# EasyEDA Pro project ProPrj_基于STM32的多功能串口分析仪_2025-03-12.epro, schematic Schematic1
Create Date: 2024-09-28; Page Name: P1; Project Name: 基于STM32的多功能串口分析仪; Schematic Name: Schematic1; Update Date: 2024-10-16; Company: 嘉立创EDA; Page Size: A4; Version: V1.0
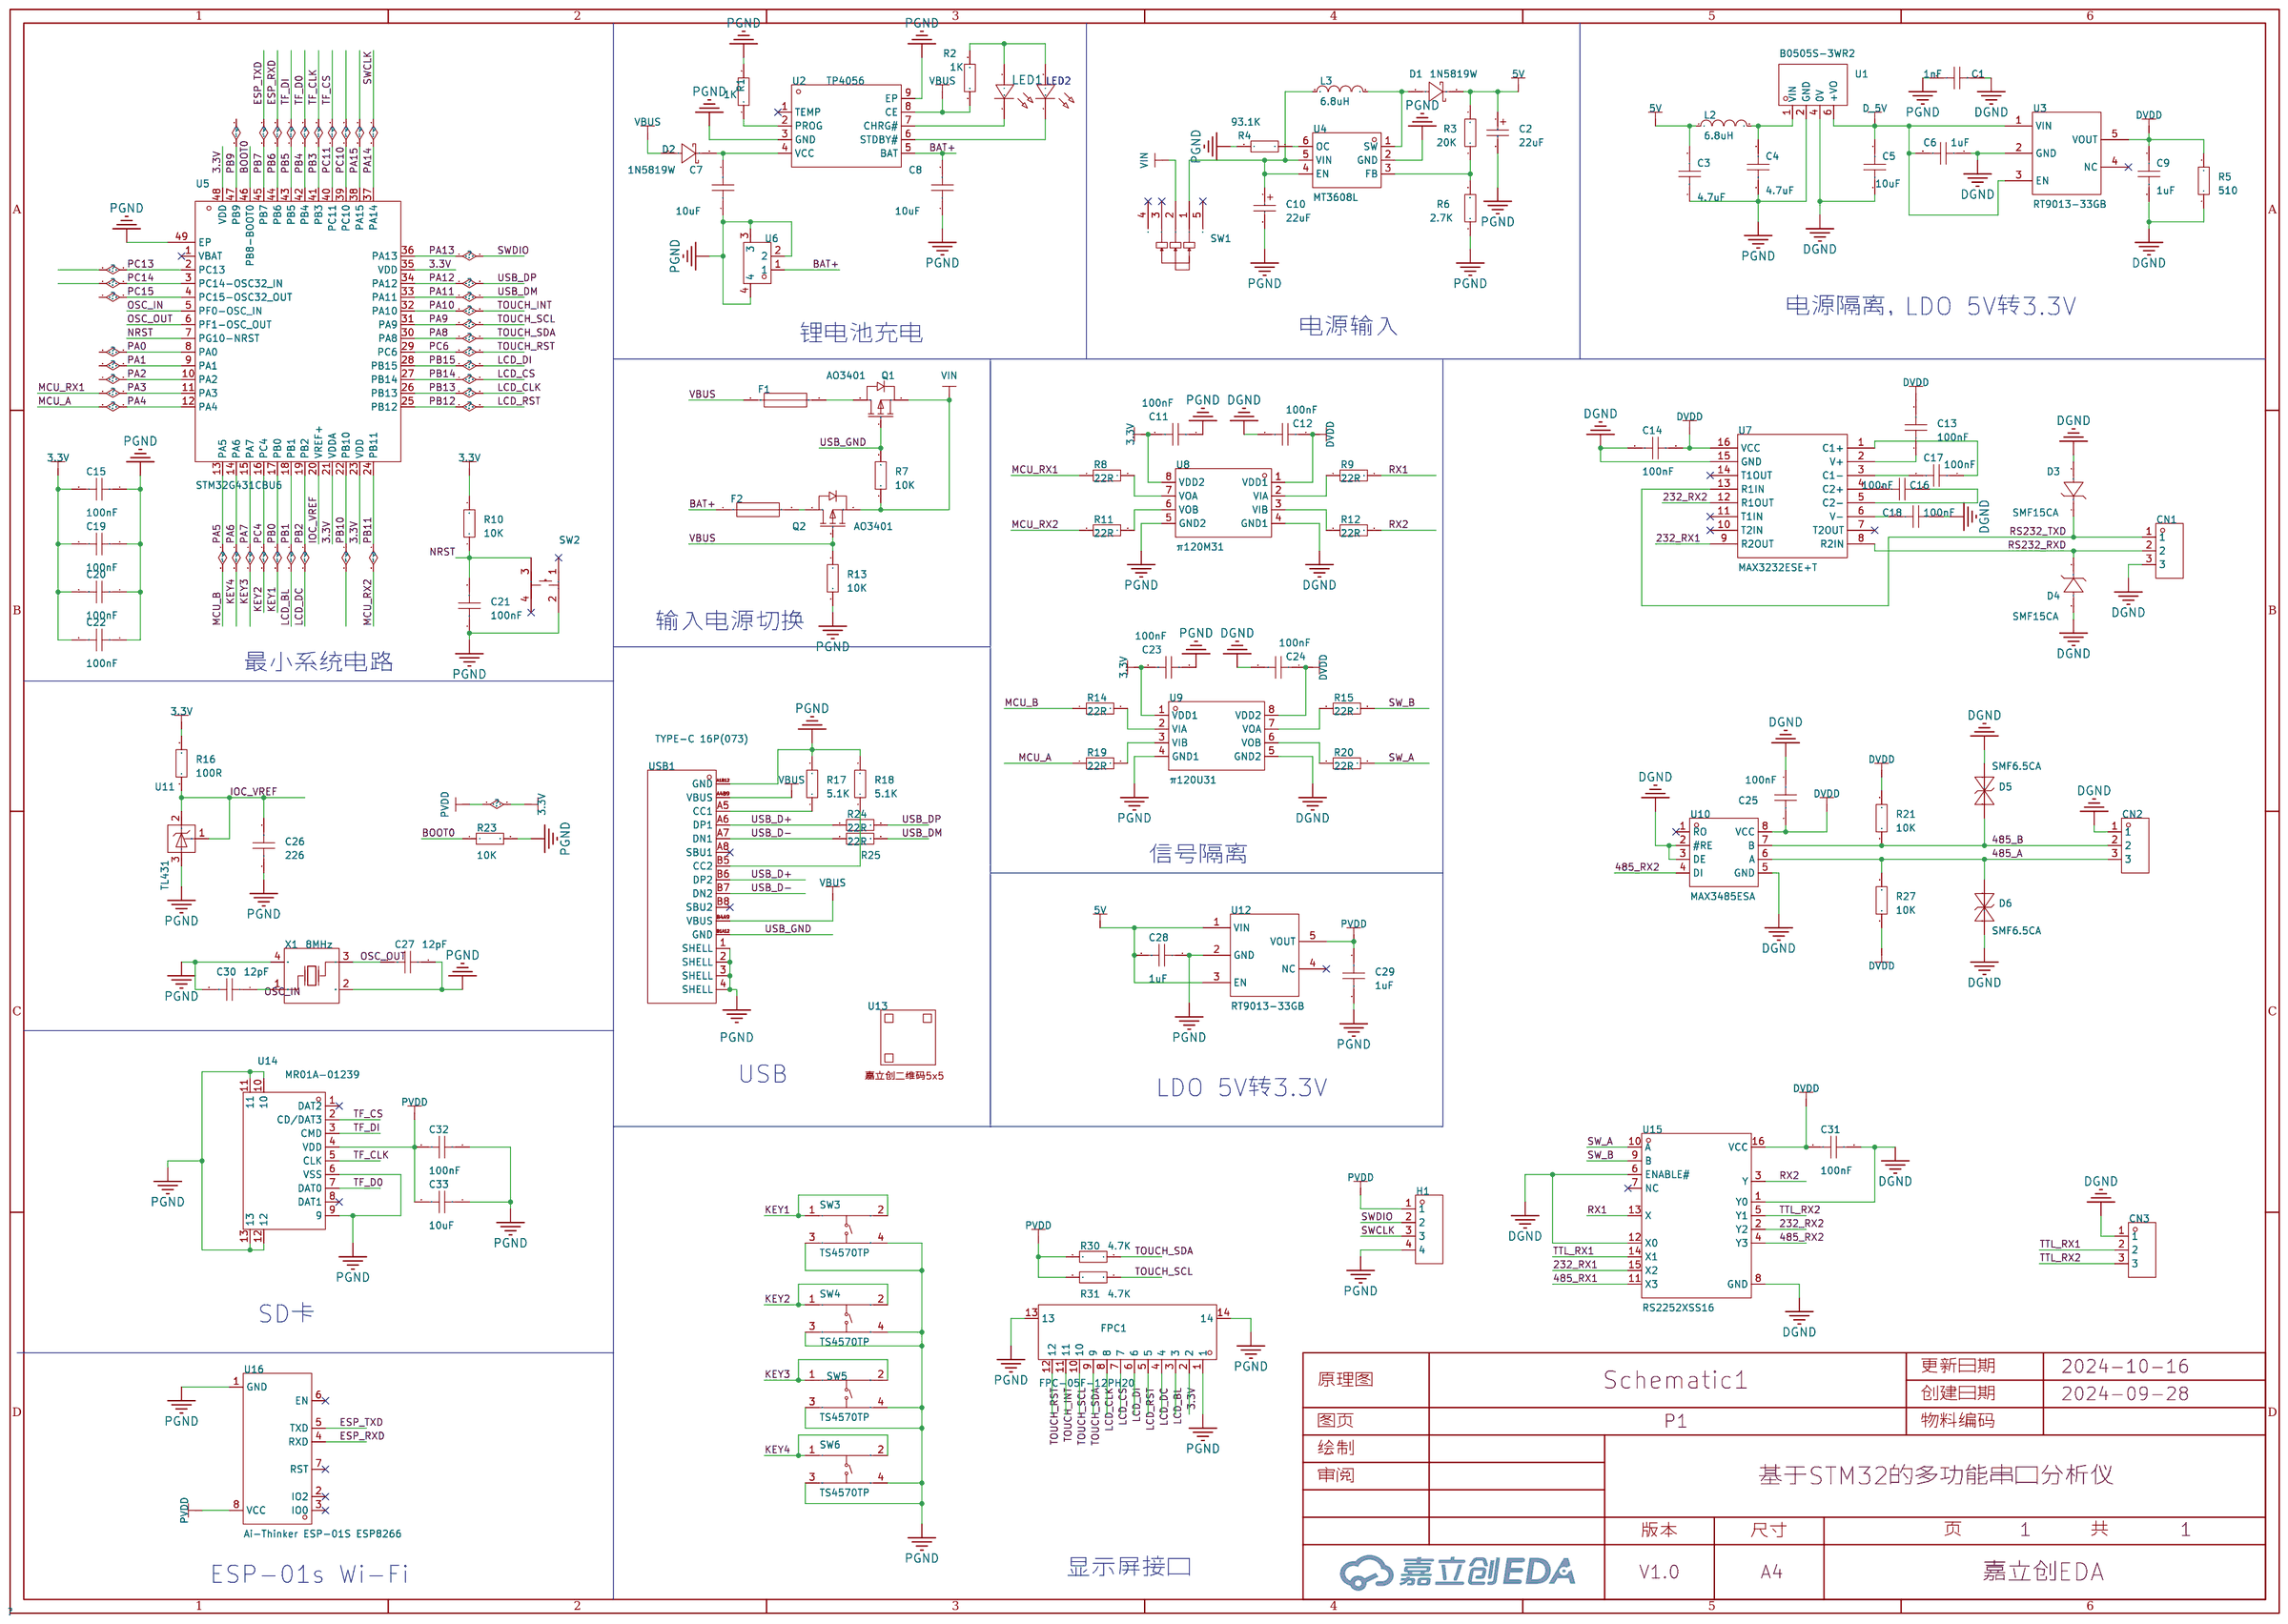
[diagram p5: schematic sheet]

## Parts
C1  1nF  [C0603]
C2  22uF  [C_Ele_SMD_5x5.4mm]
C3  4.7uF  [C0603]
C4  4.7uF  [C0603]
C5  10uF  [C0603]
C6  1uF  [C0603]
C7  10uF  [C0603]
C8  10uF  [C0603]
C9  1uF  [C0603]
C10  22uF  [C_Ele_SMD_5x5.4mm]
C11  100nF  [C0603]
C12  100nF  [C0603]
C13  100nF  [C0603]
C14  100nF  [C0603]
C15  100nF  [C0603]
C16  100nF  [C0603]
C17  100nF  [C0603]
C18  100nF  [C0603]
C19  100nF  [C0603]
C20  100nF  [C0603]
C21  100nF  [C0603]
C22  100nF  [C0603]
C23  100nF  [C0603]
C24  100nF  [C0603]
C25  100nF  [C0603]
C26  226  [C0603]
C27  12pF  [C0603]
C28  1uF  [C0603]
C29  1uF  [C0603]
C30  12pF  [C0603]
C31  100nF  [C0603]
C32  100nF  [C0603]
C33  10uF  [C0603]
CN1  DB2ERC-3.81-3P-GN  [CONN-TH_3P-P3.81_DB2ERC-3.81-3P]
CN2  DB2ERC-3.81-3P-GN  [CONN-TH_3P-P3.81_DB2ERC-3.81-3P]
CN3  DB2ERC-3.81-3P-GN  [CONN-TH_3P-P3.81_DB2ERC-3.81-3P]
D1  1N5819W  [SOD-123_L2.7-W1.6-LS3.7-RD-1]
D2  1N5819W  [SOD-123_L2.7-W1.6-LS3.7-RD-1]
D3  SMF15CA  [SOD-123FL_L2.7-W1.8-LS3.8-RD]
D4  SMF15CA  [SOD-123FL_L2.7-W1.8-LS3.8-RD]
D5  SMF6.5CA  [SOD-123FL_L2.7-W1.8-LS3.8-BI]
D6  SMF6.5CA  [SOD-123FL_L2.7-W1.8-LS3.8-BI]
F1  BSMD0805-010-33V  [F0805]
F2  BSMD0805-010-33V  [F0805]
FPC1  FPC-05F-12PH20  [FPC-SMD_12P-P0.50_FPC-05F-12PH20]
H1  -  [HDR-TH_4P-P2.54-V-F]
L2  6.8uH  [IND-SMD_L2.5-W2.0_FHD252010S-6R8MT]
L3  6.8uH  [IND-SMD_L2.5-W2.0_FHD252010S-6R8MT]
LED1  -  [LED_0805]
LED2  -  [LED_0805]
Q1  AO3401  [SOT-23-3_L2.9-W1.4-P1.90-LS2.6-BR]
Q2  AO3401  [SOT-23-3_L2.9-W1.4-P1.90-LS2.6-BR]
R1  1K  [R0603]
R2  1K  [R0603]
R3  20K  [R0603]
R4  93.1K  [R0603]
R5  510  [R0603]
R6  2.7K  [R0603]
R7  10K  [R0603]
R8  22R  [R0603]
R9  22R  [R0603]
R10  10K  [R0603]
R11  22R  [R0603]
R12  22R  [R0603]
R13  10K  [R0603]
R14  22R  [R0603]
R15  22R  [R0603]
R16  100R  [R0603]
R17  5.1K  [R0603]
R18  5.1K  [R0603]
R19  22R  [R0603]
R20  22R  [R0603]
R21  10K  [R0603]
R23  10K  [R0603]
R24  22R  [R0603]
R25  22R  [R0603]
R27  10K  [R0603]
R30  4.7K  [R0603]
R31  4.7K  [R0603]
SW1  SK12D07VG5  [SW-TH_SK12D07VG5]
SW2  TS3425BA  [SW-SMD_4P-L4.2-W3.2-P2.15-LS4.6-1]
SW3  TS4570TP  [SW-SMD_4P-L4.5-W4.5-P3.00-LS7.0]
SW4  TS4570TP  [SW-SMD_4P-L4.5-W4.5-P3.00-LS7.0]
SW5  TS4570TP  [SW-SMD_4P-L4.5-W4.5-P3.00-LS7.0]
SW6  TS4570TP  [SW-SMD_4P-L4.5-W4.5-P3.00-LS7.0]
U1  B0505S-3WR2  [PWRM-TH_B0505S-3WR2]
U2  TP4056  [ESOP-8_L4.9-W3.9-P1.27-LS6.0-BL-EP]
U3  RT9013-33GB  [SOT-23-5_L3.0-W1.7-P0.95-LS2.8-BL]
U4  MT3608L  [SOT-23-6_L2.9-W1.6-P0.95-LS2.8-BL_3]
U5  STM32G431CBU6  [UFQFPN-48_L7.0-W7.0-P0.50-BL-EP]
U6  ZX-XH2.54-2PLT  [CONN-SMD_2P-P2.50_HCTL_HC-XH-2ALT]
U7  MAX3232ESE+T  [SOIC-16_L9.9-W3.9-P1.27-LS6.0-BL]
U8  π120M31  [SOIC-8_L4.9-W3.9-P1.27-LS6.0-BL]
U9  π120U31  [soic-8_l5.0-w4.0-p1.27-ls6.0-bl]
U10  MAX3485ESA  [SOP-8_L5.0-W4.0-P1.27-LS6.0-BL]
U11  TL431  [SOT-23-3_L2.9-W1.3-P1.90-LS2.4-BR]
U12  RT9013-33GB  [SOT-23-5_L3.0-W1.7-P0.95-LS2.8-BL]
U13  -  [JLC-QRCODE-5x5]
U14  MR01A-01239  [TF-SMD_MR01A-01211]
U15  RS2252XSS16  [SSOP-16_L4.9-W3.9-P0.635-LS6.0-BL]
U16  Ai-Thinker ESP-01S ESP8266  [WIFIM-TH_8P-L24.7-W14.4-P2.54]
USB1  TYPE-C 16P(073)  [USB-C-SMD_TYPE-C16PIN_C668624]
X1  8MHz  [CRYSTAL-SMD_4P-L3.2-W2.5-BL]

## Library data of the parts
C1 C3-C9 C11-C33 = CAP_0603: Supplier Footprint: 0603
C2 C10 = C_Ele_SMD_5x5.4mm: Supplier Footprint: SMD,5x5.4mm
CN1-CN3 = DB2ERC-3.81-3P-GN: 连接器类型:板端/插座-闭口;结构:1x3P;间距:3.81mm;颜色:绿色;安装方式:弯针;排数:1;每排PIN数:3;额定电流:10A;额定电压:250V;工作温度范围:-40℃~+105℃;; LCSC Part Name: 3.81mm 1x3P 排数:1 每排P数:3; Supplier Part: C395690; Manufacturer: DORABO(地博电气); Supplier Footprint: 弯插,P=3.81mm; Datasheet: https://atta.szlcsc.com/upload/public/pdf/source/20221115/4E217E7D538220F8720C137D6A05E519.pdf; Supplier: LCSC; Connector Type: 板端/插座-闭口; Structure: 1x3P; Pitch: 3.81mm; Color: 绿色; Mounting Style: 弯针; Number of Pins: 3P; Number of Rows: 1; Number of PINs Per Row: 3; Current Rating (Max): 10A; Voltage Rating (Max): 250V; Operating Temperature Range: -40℃~+105℃
D1 D2 = 1N5819W: 二极管配置:-;正向压降(Vf):900mV@3A;直流反向耐压(Vr):40V;平均整流电流(Io):1A;; LCSC Part Name: 电压:40V 电流:1A; Supplier Part: C2905650; Manufacturer: TECH PUBLIC(台舟); Supplier Footprint: SOD-123; Datasheet: https://atta.szlcsc.com/upload/public/pdf/source/20211020/7FEA34DA99E5285CBA3CC87767B82BE7.pdf; Supplier: LCSC; Forward Voltage (Vf@If): 900mV@3A; Reverse Voltage (Vr): 40V; Average Rectified Current (Io): 1A; Reverse Leakage Current (Ir): 1mA@40V
D3 D4 = SMF16CA_C19077511: 极性:双向;反向截止电压(Vrwm):16V;最大钳位电压:26V;峰值脉冲电流(Ipp)@10/1000us:7.7A;峰值脉冲功率(Ppp)@10/1000us:200W;击穿电压:17.8V;; LCSC Part Name: SMF16CA; Supplier Part: C19077511; Manufacturer: 宏迦橙; Supplier Footprint: SOD-123FL; Datasheet: https://atta.szlcsc.com/upload/public/pdf/source/20231129/4813F17DC56F8B344A8D004597B3633C.pdf; Supplier: LCSC; polarity: 双向; Reverse Stand-Off Voltage (Vrwm): 16V; Maximum Clamping Voltage: 26V; Peak Pulse Current (Ipp)@10/1000us: 7.7A; Peak Pulse Power Dissipation (Ppp)@10/1000us: 200W; Breakdown Voltage: 17.8V; Reverse Leakage Current (Ir): 1uA; Number of Lines: 单路; Operating Temperature: -55℃~+155℃; Type: TVS
D5 D6 = SMF6.5CA_C19077501: 极性:双向;反向截止电压(Vrwm):6.5V;最大钳位电压:11.2V;峰值脉冲电流(Ipp)@10/1000us:17.9A;峰值脉冲功率(Ppp)@10/1000us:200W;击穿电压:7.22V;; Supplier Part: C19077501; Manufacturer: 宏迦橙; Supplier Footprint: SOD-123FL; Datasheet: https://atta.szlcsc.com/upload/public/pdf/source/20231201/BA209EB353689BD2A9785188AB9E10B0.pdf; Supplier: LCSC; polarity: 双向; Reverse Stand-Off Voltage (Vrwm): 6.5V; Maximum Clamping Voltage: 11.2V; Peak Pulse Current (Ipp)@10/1000us: 17.9A; Peak Pulse Power Dissipation (Ppp)@10/1000us: 200W; Breakdown Voltage: 7.22V; Reverse Leakage Current (Ir): 1uA; Number of Lines: 单路; Operating Temperature: -55℃~+155℃; Type: TVS
F1 F2 = BSMD0805-010-33V: 最大电压:33V;最大电流:40A;保持电流:100mA;跳闸电流:300mA;; LCSC Part Name: 0805 0.1A 33V 国产高电压; Supplier Part: C883101; Manufacturer: BHFUSE(佰宏); Supplier Footprint: 0805; Datasheet: https://atta.szlcsc.com/upload/public/pdf/source/20230512/7A46D6CD923C15CBB98FD769C08EDD80.pdf; Supplier: LCSC; Operating Voltage (Max): 33V; Current Rating (Max): 40A; Hold Current: 100mA; Trip Current: 300mA; Power Dissipation: 500mW; Resistance - Initial (Ri) (Min): 750mΩ; Resistance - Post Trip (R1) (Max): 6Ω; Maximum Time to Trip: 1.5s; Operating Temperature: -40℃~+85℃
FPC1 = FPC-05F-12PH20: 锁定特性:翻盖式;触点类型:下接;触点数量:12P;间距:0.5mm;安装类型:卧贴;工作温度范围:-25℃~+85℃;; LCSC Part Name: 间距:0.5mm P数:12P 翻盖式 下接; Supplier Part: C2856799; Manufacturer: XUNPU(讯普); Supplier Footprint: SMD,P=0.5mm,卧贴; Datasheet: https://atta.szlcsc.com/upload/public/pdf/source/20210922/C2856799_794322F63241F1C59819430844B946BA.pdf; Supplier: LCSC; Locking Feature: 翻盖式; Contact Type: 下接; Number of Contacts: 12P; Pitch: 0.5mm; Mounting Type: 卧贴; FFC, FCB Thickness: 0.3mm; Height Above Board: 2mm; Operating Temperature Range: -25℃~+85℃
H1 = HDR-F_2.54_1x4P: Supplier Part: C2718488; Supplier Footprint: 插件
L2 L3 = FHD252010S-6R8MT: 电感值:6.8uH;精度:±20%;额定电流:1A;饱和电流(Isat):1.15A;; LCSC Part Name: 6.8uH ±20% 1.15A; Supplier Part: C602006; Manufacturer: cjiang(长江微电); Supplier Footprint: 1008; Datasheet: https://atta.szlcsc.com/upload/public/pdf/source/20200609/C601990_BCEA243EC4DA0A9A288AA78A6DFB48A5.pdf; Supplier: LCSC; Tolerance: ±20%; Rated Current: 1A; Saturation Current (Isat): 1.15A; DC Resistance (DCR): 380mΩ
LED1 = LED_0805-R: Supplier Footprint: 0805
LED2 = LED_0805-G: Supplier Footprint: 0805
Q1 Q2 = AO3401_C727156: 类型:1个P沟道;漏源电压(Vdss):30V;连续漏极电流(Id):4.2A;功率(Pd):350mW;导通电阻(RDS(on)@Vgs,Id):65mΩ@10V,4.2A;阈值电压(Vgs(th)@Id):1.3V@250uA;; LCSC Part Name: 1个P沟道 耐压:30V 电流:4.2A; Supplier Part: C727156; Manufacturer: TWGMC(台湾迪嘉); Supplier Footprint: SOT-23; Datasheet: https://atta.szlcsc.com/upload/public/pdf/source/20200827/C727156_6E081BBEEFBC6B8FEE164CB196B0AF30.pdf; Supplier: LCSC; Type: 1个P沟道; Drain Source Voltage (Vdss): 30V; Continuous Drain Current (Id): 4.2A; Power Dissipation (Pd): 350mW; Drain Source On Resistance (RDS(on)@Vgs,Id): 65mΩ@10V,4.2A; Gate Threshold Voltage (Vgs(th)@Id): 1.3V@250uA
R1-R21 R23-R25 R27 R30 R31 = Res_0603: Supplier Footprint: 0603
SW1 = SK12D07VG5: 电路结构:单刀双掷;安装方式:侧插;开关颜色:-;额定电流(DC):500mA;额定电压(DC):50V;额定电流(AC):-;额定电压(AC):-;机械寿命:5千次;; LCSC Part Name: 两档位卧式拨动开关,柄长5MM; Supplier Part: C431548; Manufacturer: SHOU HAN(首韩); Supplier Footprint: 插件; Datasheet: https://atta.szlcsc.com/upload/public/pdf/source/20190925/C431548_D6571AEBDE139FDB1E6F8A4B1513A630.pdf; Supplier: LCSC; Circuit: 单刀双掷; Pin Style: PC引脚; Switch Length: 8.7mm; Switch Width: 4.4mm; Switch Height: 4.7mm; Mounting Style: 侧插; Current Rating (DC): 500mA; Voltage Rating (DC): 50V; Mechanical Life: 5千次; Operating Temperature: -10℃~+50℃
SW2 = TS3425BA: 电路结构:单刀单掷;按钮形状:椭圆形按钮;作用力:250gf;安装方式:立贴;开关长度:4.2mm;开关宽度:3.2mm;开关高度:2.5mm;带支架:不带;触点电流:50mA;额定电压(DC):12V;绝缘电阻:100MΩ;机械寿命:10万次;; LCSC Part Name: 4.2*3.2*2.5mm 立贴 轻触开关; Supplier Part: C2681476; Manufacturer: SHOU HAN(首韩); Supplier Footprint: SMD; Datasheet: https://atta.szlcsc.com/upload/public/pdf/source/20210107/C2681476_BF217B2301F0070AA49504CB0BFDE895.pdf; Supplier: LCSC; Circuit: 单刀单掷; Actuator Style: 椭圆形按钮; Operating Force: 250gf; Mounting Style: 立贴; Switch Length: 4.2mm; Switch Width: 3.2mm; Switch Height: 2.5mm; Strike Gundam: 不带; Contact Current: 50mA; Voltage Rating (DC): 12V; Insulation Resistance: 100MΩ; Actuator/Cap Color: 白色; Pin Style: J型引脚; Mechanical Life: 10万次; Operating Temperature: -20℃~+85℃
SW3-SW6 = TS4570TP: 电路结构:单刀单掷;按钮形状:圆形按钮;作用力:250gf;安装方式:立贴;开关长度:4.5mm;开关宽度:4.5mm;开关高度:7mm;带支架:不带;触点电流:50mA;额定电压(DC):12V;绝缘电阻:100MΩ;机械寿命:5万次;; LCSC Part Name: 4.5*4.5*7mm 立贴 轻触开关; Supplier Part: C557609; Manufacturer: SHOU HAN(首韩); Supplier Footprint: SMD; Datasheet: https://atta.szlcsc.com/upload/public/pdf/source/20200519/C557609_79A658DA402A75A9146B8D0EB3A4F5AE.pdf; Supplier: LCSC; Circuit: 单刀单掷; Actuator Style: 圆形按钮; Operating Force: 250gf; Mounting Style: 立贴; Switch Length: 4.5mm; Switch Width: 4.5mm; Switch Height: 7mm; Strike Gundam: 不带; Contact Current: 50mA; Voltage Rating (DC): 12V; Insulation Resistance: 100MΩ; Actuator/Cap Color: 黑色; Pin Style: 鸥翼型; Mechanical Life: 5万次
U1 = B0505S-3WR2_C5369498: 支持100%全国产，B0505S-3WR2品是专门应用在分布式电源系统中需要产生一路与输入电源隔离的电源的应用场合而设计。该产品适用于：纯数字电路，一般低频模拟电路，继电器驱动电路，数据交换电路等输出电压15V，输出电流（mA）200，可持续 短路保护空载输入电流低至4mA效率高达85%低纹波系数和低噪音隔离电压 1500VDC国际标准引脚方式工作温度范围：-40℃ ~+105℃可根据客户需求设计特殊规格产品●; LCSC Part Name: DC-DC 输入电压4.5V~5.5V 输出电压5V输出功率3W600mA; Supplier Part: C5369498; Manufacturer: YLPTEC(易川); Supplier Footprint: SIP-4; Datasheet: https://atta.szlcsc.com/upload/public/pdf/source/20230417/78355FDB466A614ED9BF545F60A618F8.pdf; Supplier: LCSC
U2 = TP4056_C725790: Supplier Part: C725790; Manufacturer: UMW(友台半导体); Supplier Footprint: ESOP-8; Datasheet: https://atta.szlcsc.com/upload/public/pdf/source/20231109/CF74897CE79A500F7FE27A45ADCCC631.pdf; Supplier: LCSC
U3 U12 = RT9013-33GB: 输出类型:固定;最大输入电压:5.5V;输出电压:3.3V;最大输出电流:500mA;电源纹波抑制比(PSRR):50dB@(10kHz);输出极性:正极;; LCSC Part Name: 输入5.5V 输出3.3V 500mA; Supplier Part: C47773; Manufacturer: RICHTEK(立锜); Supplier Footprint: SOT-23-5; Datasheet: https://atta.szlcsc.com/upload/public/pdf/source/20150504/1457707282459.pdf; Supplier: LCSC; Output Type: 固定; Maximum Input Voltage: 5.5V; Output Voltage: 3.3V; MAX Output Current: 500mA; Power Supply Rejection Ratio (PSRR): 50dB@(10kHz); Dropout Voltage: 400mV@(500mA); standby current: 50uA; Operating Temperature: -40℃~+85℃; Output Polarity: 正极; Number of Outputs: 1
U4 = MT3608L: Supplier Part: C2932326; Manufacturer: 西安航天民芯; Supplier Footprint: SOT-23-6; Datasheet: https://atta.szlcsc.com/upload/public/pdf/source/20211213/953A62CC1033762E00AABAD4906DD7F1.pdf; Supplier: LCSC
U5 = STM32G431CBU6: CPU内核:-;程序存储容量:128KB;RAM总容量:32KB;GPIO端口数量:42;工作电压范围:1.71V~3.6V;CPU最大主频:170MHz;程序存储器类型:FLASH;; LCSC Part Name: 带DSP和FPU的170MHz主流ARM Cortex-M4 MCU，具有128 KB Flash存储器、数学加速器和中等模拟电平集成; Supplier Part: C529356; Manufacturer: ST(意法半导体); Supplier Footprint: UFQFPN-48(7x7); JLCPCB Part Class: 扩展库; Datasheet: https://atta.szlcsc.com/upload/public/pdf/source/20200511/C529354_7C66CF00837B904D0C15DCE45B69418C.pdf; Supplier: LCSC; Program Storage Size: 128KB; RAM Size: 32KB; GPIO Ports Number: 42; Operating Voltage Range: 1.71V~3.6V; CPU Maximum Speed: 170MHz; Program Memory Type: FLASH; Operating Temperature Range: -40℃~+85℃; ADC (Bit): 12bit; DAC (Bit): 12bit; Peripheral/Function: DMA；PWM; Watchdog: 有; Infrared Data Association: 有; Low-Voltage Detect: 有; Direct Memory Access: 有; Internal Oscillator: 有
U6 = ZX-XH2.54-2PLT: 插针结构:1x2P;间距:2.54mm;安装方式:立贴;参考系列:XH;总PIN数:2P;排数:1;每排PIN数:2;行距:-;额定电流:3A;触头材质:黄铜;触头镀层:锡;工作温度范围:-25℃~+85℃;; Supplier Part: C7429680; Manufacturer: Megastar(兆星); Supplier Footprint: SMD,P=2.54mm; Datasheet: https://atta.szlcsc.com/upload/public/pdf/source/20230619/87C018EBE425F10E4B035B436CF5FBBC.pdf; Supplier: LCSC; Pins Structure: 1x2P; Pitch: 2.54mm; Mounting Style: 立贴; Reference Series: XH; Number of Pins: 2P; Number of Rows: 1; Number of PINs Per Row: 2; Current Rating (Max): 3A; Contact Material: 黄铜; Contact Plating: 锡; Operating Temperature Range: -25℃~+85℃
U7 = MAX3232ESE+T: 类型:收发器;驱动器/接收器:2/2;数据速率:250Kbps;; LCSC Part Name: 3.0V至5.5V、低功耗、1Mbps、真RS-232收发器; Supplier Part: C15846; Manufacturer: ADI(亚德诺)/MAXIM(美信); Supplier Footprint: SOIC-16; Datasheet: https://atta.szlcsc.com/upload/public/pdf/source/20220812/1D5DF2FF91750DFE63BD771071C0B1F6.pdf; Supplier: LCSC; Types: 收发器; Driver/receiver: 2/2; Data Rate: 250Kbps; Supply Voltage: 3V~5.5V; Operating Temperature: -40℃~+85℃
U8 = π120M31: 应用:-;通道数:2;隔离电压(Viso):3000Vrms;隔离技术:-;; Supplier Part: C471592; Manufacturer: 2Pai Semi(荣湃); Supplier Footprint: SOIC-8; Datasheet: https://atta.szlcsc.com/upload/public/pdf/source/20191223/C471592_86EB6BBF77F34161B2D4E2AA9B2A436E.pdf; Supplier: LCSC; Voltage Isolation or Not: 带电压隔离; Supply Voltage: 3V~5.5V; Data Rate: 10Mbps; Number of Channels: 2; Isolation voltage: 3000Vrms; Forward Channel: 2; Reverse channel: 0
U9 = π120U31: 应用:通用;通道数:2;隔离电压(Viso):3000Vrms;隔离技术:-;; LCSC Part Name: 增强型ESD 3.0kVrms/6.0kVrms 150Kbps双通道数字隔离器; Supplier Part: C471588; Manufacturer: 2Pai Semi(荣湃); Supplier Footprint: SOIC-8; Datasheet: https://atta.szlcsc.com/upload/public/pdf/source/20191223/C471588_CD8CD4905F4DCC0F3407249B7C47B378.pdf; Supplier: LCSC; Applications: 通用; Voltage Isolation or Not: 带电压隔离; Supply Voltage: 3V~5.5V; Data Rate: 150Kbps; Number of Channels: 2; Isolation voltage: 3000Vrms; Forward Channel: 2; Reverse channel: 0
U10 = MAX3485ESA: 类型:收发器;数据速率:12Mbps;驱动器/接收器:1/1;; Supplier Part: C668204; Manufacturer: UMW(友台半导体); Supplier Footprint: SOP-8; Datasheet: https://atta.szlcsc.com/upload/public/pdf/source/20231109/DDD7CD3D891754087D6BC3897133907F.pdf; Supplier: LCSC; Types: 收发器; Supply Voltage: 2.97V~3.63V; Data Rate: 12Mbps; Driver/receiver: 1/1; Operating Temperature: -40℃~+85℃
U11 = TL431_C2914425: 输出类型:可调;输入电压:37V;输出电压:2.5V~36V;输出电流:-;精度:±0.5%;; Supplier Part: C2914425; Manufacturer: MSKSEMI(美森科); Supplier Footprint: SOT-23; JLCPCB Part Class: 扩展库; Datasheet: https://atta.szlcsc.com/upload/public/pdf/source/20220331/21EBFB8FAE95C5EE73F8EC33D24361D7.pdf; Supplier: LCSC; Output Type: 可调; Input Voltage: 37V; Output Voltage: 2.5V~36V; Tolerance: ±0.5%; Temperature Coefficient: 50ppm/℃; Reference Type: 并联; Minimum Cathode Current for Regulation: 1mA; Dynamic Impedance: 150mΩ; Operating Temperature: -20℃~+85℃@(Topr)
U13 = 嘉立创二维码5x5
U14 = MR01A-01239: LCSC Part Name: MICRO SD CARD PUSH 外焊型 带锁卡功能 功能区镀金3u″锡脚镀雾纯锡至少160u″卷装; Supplier Part: C2891857; Manufacturer: ATOM(爱特姆); Supplier Footprint: SMD; Datasheet: https://atta.szlcsc.com/upload/public/pdf/source/20220228/F2FB385E664216F5F9F5E4078ECAFC8D.pdf; Supplier: LCSC
U15 = RS2252XSS16: Supplier Part: C5372470; Manufacturer: RUNIC(润石); Supplier Footprint: SSOP-16; JLCPCB Part Class: 扩展库; Datasheet: https://atta.szlcsc.com/upload/public/pdf/source/20230310/A3B66667A7FADAC60D2742739B00933D.pdf; Supplier: LCSC
U16 = Ai-Thinker ESP-01S ESP8266: Supplier Part: C17606792; Manufacturer: Ai-Thinker(安信可); Datasheet: https://atta.szlcsc.com/upload/public/pdf/source/20231114/222F17D2D3CF5251F299F9D2AAC45260.pdf; Supplier: LCSC
USB1 = TYPE-C 16P(073): 连接器类型:Type-C;标准:USB 3.1;公母:母;安装方式:卧贴;触点数量:16P;端口数量:1;额定电流 - 电源:5A;工作温度范围:-25℃~+85℃;; LCSC Part Name: Type-C 母 卧贴; Supplier Part: C668624; Manufacturer: SHOU HAN(首韩); Supplier Footprint: SMD; Datasheet: https://atta.szlcsc.com/upload/public/pdf/source/20200618/C668624_CC51EC37614090AAD56C1421DE954C80.pdf; Supplier: LCSC; Connector Type: Type-C; Standard: USB 3.1; Gender: 母; Mounting Style: 卧贴; Number of Contacts: 16P; Number of Ports: 1; Current Rating - Power (Max): 5A; Operating Temperature Range: -25℃~+85℃; Rated Voltage (Max): 5V; Connect-Disconnect Life: 1万次; Core Colour: 黑色
X1 = X322524MOB4SI: 晶振类型:贴片晶振;频率:24MHz;常温频差:±10ppm;外接负载电容:12pF;频率稳定度(全温):±20ppm;; LCSC Part Name: 24MHz ±10ppm 12pF; Supplier Part: C70590; Manufacturer: YXC(扬兴晶振); Supplier Footprint: SMD3225-4P; JLCPCB Part Class: Extended Part; Datasheet: https://atta.szlcsc.com/upload/public/pdf/source/20240329/19D5F850207469550BEB00D7DFEDBC7A.pdf; Supplier: LCSC; Crystal Type: 贴片晶振; Normal temperature Frequency Tolerance: ±10ppm; External load capacitor: 12pF; Frequency Stability(Full temperature range): ±20ppm; Operating Temperature: -40℃~+85℃

## Nets
3.3V: C11.2 C15.2 C19.2 C20.2 C22.2 C23.2 C29.1 C32.2 C33.2 FPC1.2 H1.1 R10.2 R16.2 R30.2 R31.2 U5.21(VDDA) U5.23(VDD) U5.35(VDD) U5.48(VDD) U8.8(VDD2) U9.1(VDD1) U12.5(VOUT) U14.4(VDD) U16.8(VCC)
5V: C2.1 C3.2 C28.2 D1.1(K) L2.1 R3.2 U12.1(VIN) U12.3(EN)
DGND: C1.2 C5.1 C6.1 C9.2 C12.2 C14.1 C18.1 C24.2 C25.1 C31.1 CN1.3 CN2.1 CN3.1 D3.2(A) D4.2(A) D5.1 D6.1 R5.1 U1.4(0V) U3.2(GND) U7.15(GND) U8.4(GND1) U9.5(GND2) U10.2(#RE) U10.3(DE) U10.5(GND) U15.1(Y0) U15.6(ENABLE#) U15.8(GND) U15.12(X0)
DVDD: C9.1 C12.1 C13.2 C14.2 C24.1 C25.2 C31.2 R5.2 R21.2 R27.1 U3.5(VOUT) U7.16(VCC) U8.1(VDD1) U9.8(VDD2) U10.8(VCC) U15.16(VCC)
PGND: C1.1 C2.2 C3.1 C4.1 C7.1 C8.1 C10.2 C11.1 C15.1 C19.1 C20.1 C21.1 C22.1 C23.1 C26.1 C27.1 C28.1 C29.2 C30.2 C32.1 C33.1 FPC1.1 FPC1.13 FPC1.14 H1.4 R1.2 R4.1 R6.1 R13.2 R17.2 R18.2 R23.2 SW2.2 SW3.3(C) SW3.4(D) SW4.3(C) SW4.4(D) SW5.3(C) SW5.4(D) SW6.3(C) SW6.4(D) U1.2(GND) U2.3(GND) U2.9(EP) U4.2(GND) U5.49(EP) U6.2 U6.3 U6.4 U8.5(GND2) U9.4(GND1) U11.3(A) U12.2(GND) U14.6(VSS) U14.9 U14.10 U14.11 U14.12 U14.13 U16.1(GND) USB1.1(SHELL) USB1.2(SHELL) USB1.3(SHELL) USB1.4(SHELL) USB1.A1B12(GND) X1.2(GND) X1.4(GND)
VBUS: D2.2(A) F1.1 Q2.1(G) R2.2 R13.1 U2.8(CE) USB1.A4B9(VBUS) USB1.B4A9(VBUS)
VIN: Q1.2(S) Q2.2(S) R7.1 SW1.2
232_RX1: U7.9(R2OUT) U15.15(X2)
232_RX2: U7.12(R1OUT) U15.2(Y2)
485_A: CN2.3 D6.2 R27.2 U10.6(A)
485_B: CN2.2 D5.2 R21.1 U10.7(B)
485_RX1: U15.11(X3)
485_RX2: U10.4(DI) U15.4(Y3)
BAT+: C8.2 F2.1 U2.5(BAT) U6.1
BOOT0: R23.1 U5.46(PB8-BOOT0)
D_5V: C5.2 C6.2 U1.6(+VO) U3.1(VIN) U3.3(EN)
ESP_RXD: U5.44(PB6) U16.4(RXD)
ESP_TXD: U5.45(PB7) U16.5(TXD)
IOC_VREF: C26.2 R16.1 U5.20(VREF+) U11.1(REF) U11.2(C)
KEY1: SW3.1(A) SW3.2(B) U5.17(PB0)
KEY2: SW4.1(A) SW4.2(B) U5.16(PC4)
KEY3: SW5.1(A) SW5.2(B) U5.15(PA7)
KEY4: SW6.1(A) SW6.2(B) U5.14(PA6)
LCD_BL: FPC1.3 U5.18(PB1)
LCD_CLK: FPC1.8 U5.26(PB13)
LCD_CS: FPC1.7 U5.27(PB14)
LCD_DC: FPC1.4 U5.19(PB2)
LCD_DI: FPC1.6 U5.28(PB15)
LCD_RST: FPC1.5 U5.25(PB12)
MCU_A: R19.1 U5.12(PA4)
MCU_B: R14.1 U5.13(PA5)
MCU_RX1: R8.1 U5.11(PA3)
MCU_RX2: R11.1 U5.24(PB11)
NRST: C21.2 R10.1 SW2.3 U5.7(PG10-NRST)
OSC_IN: C30.1 U5.5(PF0-OSC_IN) X1.1(OSC1)
OSC_OUT: C27.2 U5.6(PF1-OSC_OUT) X1.3(OSC2)
PA0: U5.8(PA0)
PA1: U5.9(PA1)
PA2: U5.10(PA2)
PA8: FPC1.9 R30.1 U5.30(PA8)
PA9: FPC1.10 R31.1 U5.31(PA9)
PA10: FPC1.11 U5.32(PA10)
PA11: R25.2 U5.33(PA11)
PA12: R24.2 U5.34(PA12)
PA13: H1.2 U5.36(PA13)
PA14: H1.3 U5.37(PA14)
PA15: U5.38(PA15)
PB3: U5.41(PB3) U14.5(CLK)
PB4: U5.42(PB4) U14.7(DAT0)
PB5: U5.43(PB5) U14.3(CMD)
PB9: U5.47(PB9)
PB10: U5.22(PB10)
PC6: FPC1.12 U5.29(PC6)
PC10: U5.39(PC10)
PC11: U5.40(PC11) U14.2(CD/DAT3)
PC13: U5.2(PC13)
PC14: U5.3(PC14-OSC32_IN)
PC15: U5.4(PC15-OSC32_OUT)
RS232_RXD: CN1.2 D4.1(K) U7.8(R2IN)
RS232_TXD: CN1.1 D3.1(K) U7.13(R1IN)
RX1: R9.2 U15.13(X)
RX2: R12.2 U15.3(Y)
SW_A: R20.2 U15.10(A)
SW_B: R15.2 U15.9(B)
TTL_RX1: CN3.2 U15.14(X1)
TTL_RX2: CN3.3 U15.5(Y1)
USB_D+: R24.1 USB1.A6(DP1) USB1.B6(DP2)
USB_D-: R25.1 USB1.A7(DN1) USB1.B7(DN2)
USB_GND: Q1.1(G) R7.2 USB1.B1A12(GND)
$1N5356: R17.1 USB1.A5(CC1)
$1N5357: R18.1 USB1.B5(CC2)
$1N5372: C4.2 L2.2 U1.1(VIN)
$1N5435: R8.2 U8.7(VOA)
$1N5438: R11.2 U8.6(VOB)
$1N5439: R9.1 U8.2(VIA)
$1N5442: R12.1 U8.3(VIB)
$1N5453: C17.2 U7.3(C1-)
$1N5454: C16.2 U7.4(C2+)
$1N5455: C16.1 U7.5(C2-)
$1N5456: C18.2 U7.6(V-)
$1N5517: C17.1 U7.1(C1+)
$1N5518: C13.1 U7.2(V+)
$1N7538: R1.1 U2.2(PROG)
$1N7723: LED1.1(C) U2.7(CHRG#)
$1N7727: LED2.1(C) U2.6(STDBY#)
$1N7798: LED1.2(A) LED2.2(A) R2.1
$1N8863: C7.2 D2.1(K) U2.4(VCC)
$1N9034: R4.2 U4.6(OC)
$1N9169: D1.2(A) L3.2 U4.1(SW)
$1N9277: R3.1 R6.2 U4.3(FB)
$1N19970: F2.2 Q2.3(D)
$1N20026: F1.2 Q1.3(D)
$1N27774: R14.2 U9.2(VIA)
$1N27777: R19.2 U9.3(VIB)
$1N27778: R15.1 U9.7(VOA)
$1N27781: R20.1 U9.6(VOB)
$1N28343: C10.1 L3.1 SW1.1 U4.4(EN) U4.5(VIN)

Not connected (* = marked no-connect by the designer): SW1 3* 4* 5*; SW2 1* 4*; U2 1(TEMP)*; U3 4(NC)*; U5 1(VBAT)*; U7 7(T2OUT)* 10(T2IN)* 11(T1IN)* 14(T1OUT)*; U10 1(RO)*; U12 4(NC)*; U14 1(DAT2)* 8(DAT1)*; U15 7(NC)*; U16 2(IO2)* 3(IO0)* 6(EN)* 7(RST)*; USB1 A8(SBU1)* B8(SBU2)*

## Notes on the sheet
- 电源隔离，LDO 5V转3.3V
- 电源输入
- 锂电池充电
- 输入电源切换
- 最小系统电路
- 信号隔离
- USB
- LDO 5V转3.3V
- SD卡
- ESP-01s Wi-Fi
- 显示屏接口
